# EAGLE design relay_box (EAGLE 9.6.2)
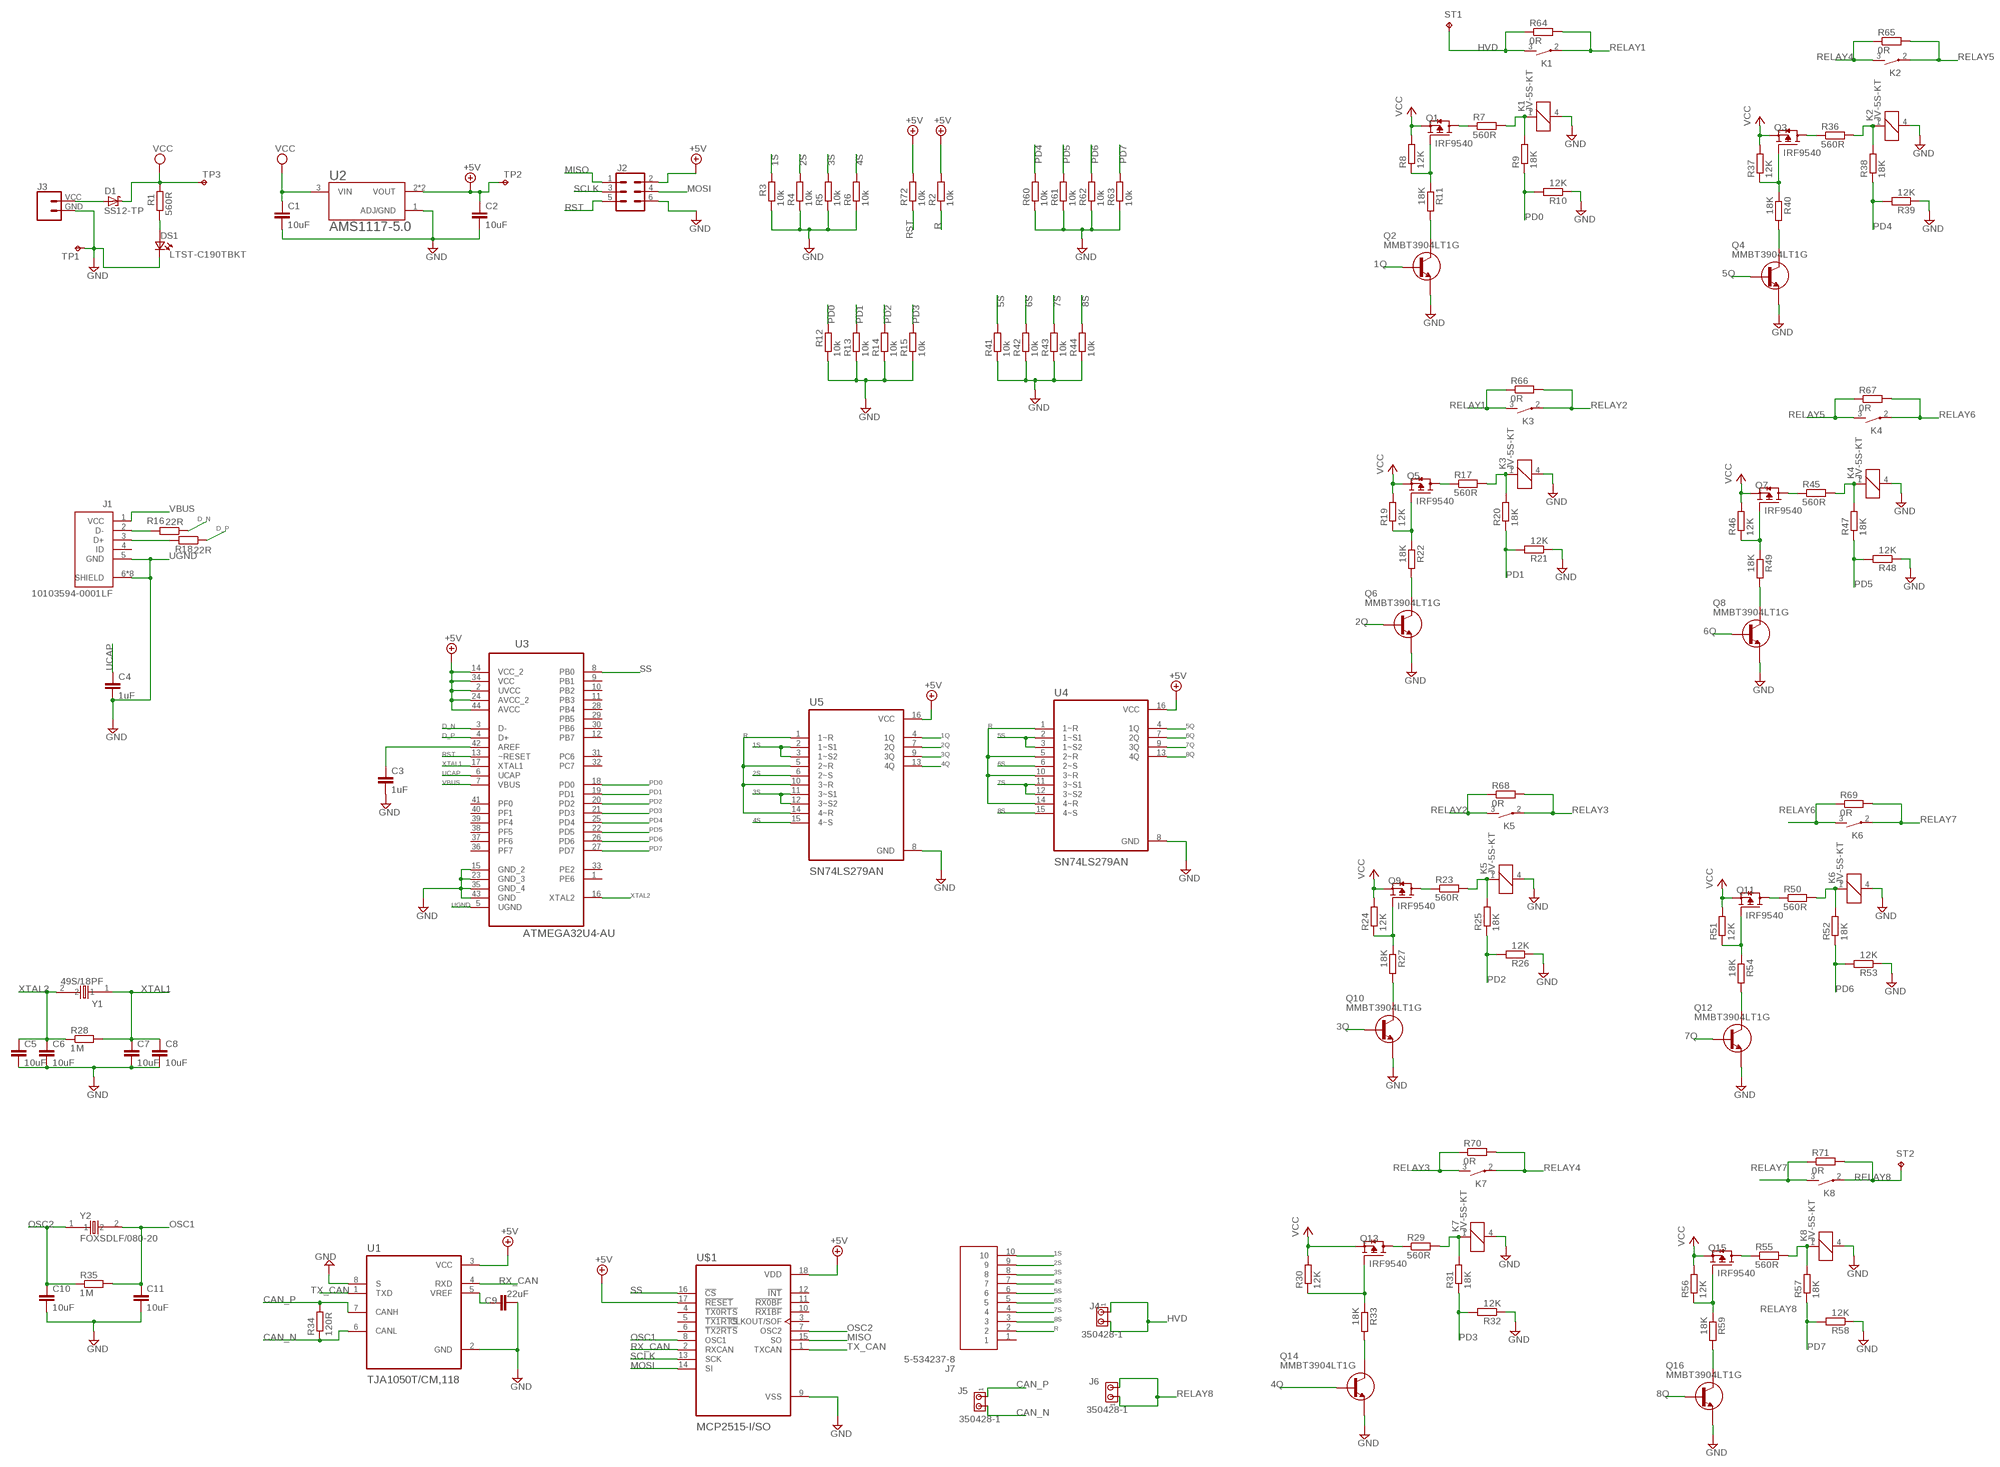
[diagram p0: schematic, sheet 1]

## Parts
C1  10uF  C-EUC0805  [C0805]
C2  10uF  C-EUC0805  [C0805]
C3  1uF  C-EUC0603  [C0603]
C4  1uF  C-EUC0603  [C0603]
C5  10uF  C-EUC0805  [C0805]
C6  10uF  C-EUC0805  [C0805]
C7  10uF  C-EUC0805  [C0805]
C8  10uF  C-EUC0805  [C0805]
C9  22uF  C-EUC0603  [C0603]
C10  10uF  C-EUC0805  [C0805]
C11  10uF  C-EUC0805  [C0805]
D1  SS12-TP  [DO214AC]
DS1  LTST-C190TBKT  [0603]
J1  10103594-0001LF  [AMPHENOL_10103594-0001LF]
J2  CONN_03X2FEMALE_SMD  [2X3_SMD]
J3  CONN_024UCON-15767  [JST-2-SMD-VERT]
J4  350428-1  [350428-1]
J5  350428-1  [350428-1]
J6  350428-1  [350428-1]
J7  5-534237-8  [RHDR10W76P0X254_1X10_2540X356X]
K1  JV-5S-KT  [JV-KT]
K2  JV-5S-KT  [JV-KT]
K3  JV-5S-KT  [JV-KT]
K4  JV-5S-KT  [JV-KT]
K5  JV-5S-KT  [JV-KT]
K6  JV-5S-KT  [JV-KT]
K7  JV-5S-KT  [JV-KT]
K8  JV-5S-KT  [JV-KT]
Q1  IRF9540  [TO254P1052X465X1989-3]
Q2  MMBT3904LT1G  [SOT23]
Q3  IRF9540  [TO254P1052X465X1989-3]
Q4  MMBT3904LT1G  [SOT23]
Q5  IRF9540  [TO254P1052X465X1989-3]
Q6  MMBT3904LT1G  [SOT23]
Q7  IRF9540  [TO254P1052X465X1989-3]
Q8  MMBT3904LT1G  [SOT23]
Q9  IRF9540  [TO254P1052X465X1989-3]
Q10  MMBT3904LT1G  [SOT23]
Q11  IRF9540  [TO254P1052X465X1989-3]
Q12  MMBT3904LT1G  [SOT23]
Q13  IRF9540  [TO254P1052X465X1989-3]
Q14  MMBT3904LT1G  [SOT23]
Q15  IRF9540  [TO254P1052X465X1989-3]
Q16  MMBT3904LT1G  [SOT23]
R1  560R  R-EU_R0805  [R0805]
R2  10k  R-EU_R0805  [R0805]
R3  10k  R-EU_R0805  [R0805]
R4  10k  R-EU_R0805  [R0805]
R5  10k  R-EU_R0805  [R0805]
R6  10k  R-EU_R0805  [R0805]
R7  560R  R-EU_0207/10  [0207/10]
R8  12K  R-EU_R0805  [R0805]
R9  18K  R-EU_R0805  [R0805]
R10  12K  R-EU_R0805  [R0805]
R11  18K  R-EU_R0805  [R0805]
R12  10k  R-EU_R0805  [R0805]
R13  10k  R-EU_R0805  [R0805]
R14  10k  R-EU_R0805  [R0805]
R15  10k  R-EU_R0805  [R0805]
R16  22R  R-EU_R0805  [R0805]
R17  560R  R-EU_0207/10  [0207/10]
R18  22R  R-EU_R0805  [R0805]
R19  12K  R-EU_R0805  [R0805]
R20  18K  R-EU_R0805  [R0805]
R21  12K  R-EU_R0805  [R0805]
R22  18K  R-EU_R0805  [R0805]
R23  560R  R-EU_0207/10  [0207/10]
R24  12K  R-EU_R0805  [R0805]
R25  18K  R-EU_R0805  [R0805]
R26  12K  R-EU_R0805  [R0805]
R27  18K  R-EU_R0805  [R0805]
R28  1M  R-EU_R0805  [R0805]
R29  560R  R-EU_0207/10  [0207/10]
R30  12K  R-EU_R0805  [R0805]
R31  18K  R-EU_R0805  [R0805]
R32  12K  R-EU_R0805  [R0805]
R33  18K  R-EU_R0805  [R0805]
R34  120R  R-EU_R0805  [R0805]
R35  1M  R-EU_R0805  [R0805]
R36  560R  R-EU_0207/10  [0207/10]
R37  12K  R-EU_R0805  [R0805]
R38  18K  R-EU_R0805  [R0805]
R39  12K  R-EU_R0805  [R0805]
R40  18K  R-EU_R0805  [R0805]
R41  10k  R-EU_R0805  [R0805]
R42  10k  R-EU_R0805  [R0805]
R43  10k  R-EU_R0805  [R0805]
R44  10k  R-EU_R0805  [R0805]
R45  560R  R-EU_0207/10  [0207/10]
R46  12K  R-EU_R0805  [R0805]
R47  18K  R-EU_R0805  [R0805]
R48  12K  R-EU_R0805  [R0805]
R49  18K  R-EU_R0805  [R0805]
R50  560R  R-EU_0207/10  [0207/10]
R51  12K  R-EU_R0805  [R0805]
R52  18K  R-EU_R0805  [R0805]
R53  12K  R-EU_R0805  [R0805]
R54  18K  R-EU_R0805  [R0805]
R55  560R  R-EU_0207/10  [0207/10]
R56  12K  R-EU_R0805  [R0805]
R57  18K  R-EU_R0805  [R0805]
R58  12K  R-EU_R0805  [R0805]
R59  18K  R-EU_R0805  [R0805]
R60  10k  R-EU_R0805  [R0805]
R61  10k  R-EU_R0805  [R0805]
R62  10k  R-EU_R0805  [R0805]
R63  10k  R-EU_R0805  [R0805]
R64  0R  R-EU_0207/10  [0207/10]
R65  0R  R-EU_0207/10  [0207/10]
R66  0R  R-EU_0207/10  [0207/10]
R67  0R  R-EU_0207/10  [0207/10]
R68  0R  R-EU_0207/10  [0207/10]
R69  0R  R-EU_0207/10  [0207/10]
R70  0R  R-EU_0207/10  [0207/10]
R71  0R  R-EU_0207/10  [0207/10]
R72  10k  R-EU_R0805  [R0805]
ST1  TPB1,27  [B1,27]
ST2  TPB1,27  [B1,27]
TP1  TPB1,27  [B1,27]
TP2  TPB1,27  [B1,27]
TP3  TPB1,27  [B1,27]
U1  TJA1050T/CM,118  [SOIC127P600X175-8N]
U2  AMS1117-5.0  [SOT229P700X180-4N]
U3  ATMEGA32U4-AU  [QFP80P1200X1200X120-44N]
U4  SN74LS279AN  [DIP794W45P254L1969H508Q16]
U5  SN74LS279AN  [DIP794W45P254L1969H508Q16]
U$1  MCP2515-I/SO  [SOIC127P1030X265-18N]
Y1  49S/18PF  [XTAL_49S/18PF]
Y2  FOXSDLF/080-20  [XTAL1170X500X450]

## Nets
1Q: Q2.1(B) U5.4(1Q)
1S: J7.10 R3.2 U5.2(1~S1) U5.3(1~S2)
2Q: Q6.1(B) U5.7(2Q)
2S: J7.9 R4.2 U5.6(2~S)
3Q: Q10.1(B) U5.9(3Q)
3S: J7.8 R5.2 U5.11(3~S1) U5.12(3~S2)
4Q: Q14.1(B) U5.13(4Q)
4S: J7.7 R6.2 U5.15(4~S)
5Q: Q4.1(B) U4.4(1Q)
5S: J7.6 R41.2 U4.2(1~S1) U4.3(1~S2)
6Q: Q8.1(B) U4.7(2Q)
6S: J7.5 R42.2 U4.6(2~S)
7Q: Q12.1(B) U4.9(3Q)
7S: J7.4 R43.2 U4.11(3~S1) U4.12(3~S2)
8Q: Q16.1(B) U4.13(4Q)
8S: J7.3 R44.2 U4.15(4~S)
+5V: C2.1 J2.2 R2.2 R72.2 TP2.TP U1.3(VCC) U2.2(VOUT) U2.4(VOUT) U3.2(UVCC) U3.14(VCC_2) U3.24(AVCC_2) U3.34(VCC) U3.44(AVCC) U4.16(VCC) U5.16(VCC) U$1.17(!RESET)
CAN_N: J5.2 R34.1 U1.6(CANL)
CAN_P: J5.1 R34.2 U1.7(CANH)
D_N: R16.1 U3.3(D-)
D_P: R18.1 U3.4(D+)
GND: C1.2 C2.2 C3.2 C5.2 C6.2 C7.2 C8.2 C9.2 C10.2 C11.2 DS1.1(K2) J2.6 J3.GND K1.4 K2.4 K3.4 K4.4 K5.4 K6.4 K7.4 K8.4 Q2.2(E) Q4.2(E) Q6.2(E) Q8.2(E) Q10.2(E) Q12.2(E) Q14.2(E) Q16.2(E) R3.1 R4.1 R5.1 R6.1 R10.1 R12.1 R13.1 R14.1 R15.1 R21.1 R26.1 R32.1 R39.1 R41.1 R42.1 R43.1 R44.1 R48.1 R53.1 R58.1 R60.1 R61.1 R62.1 R63.1 TP1.TP U1.2(GND) U1.8(S) U2.1(ADJ/GND) U3.15(GND_2) U3.23(GND_3) U3.35(GND_4) U3.43(GND) U4.8(GND) U5.8(GND) U$1.9(VSS)
HVD: J4.1 J4.2 K1.3(S) R64.1 ST1.TP
MISO: J2.1 U$1.15(SO)
MOSI: J2.4 U$1.14(SI)
N$1: Q1.1(G) R8.1 R11.1
N$2: Q1.2(D) R7.1
N$3: Q2.3(C) R11.2
N$4: K1.1 R7.2 R9.2
N$5: Q3.1(G) R37.1 R40.1
N$6: Q4.3(C) R40.2
N$7: K2.1 R36.2 R38.2
N$8: Q3.2(D) R36.1
N$9: Q5.1(G) R19.1 R22.1
N$10: Q6.3(C) R22.2
N$11: K3.1 R17.2 R20.2
N$12: Q5.2(D) R17.1
N$13: Q7.1(G) R46.1 R49.1
N$14: Q8.3(C) R49.2
N$15: K4.1 R45.2 R47.2
N$16: Q7.2(D) R45.1
N$17: Q9.1(G) R24.1 R27.1
N$18: Q10.3(C) R27.2
N$19: K5.1 R23.2 R25.2
N$20: Q9.2(D) R23.1
N$21: Q11.1(G) R51.1 R54.1
N$22: Q12.3(C) R54.2
N$23: K6.1 R50.2 R52.2
N$24: Q11.2(D) R50.1
N$25: Q13.1(G) R30.1 R33.1
N$26: Q14.3(C) R33.2
N$27: K7.1 R29.2 R31.2
N$28: Q13.2(D) R29.1
N$29: Q15.1(G) R56.1 R59.1
N$30: Q16.3(C) R59.2
N$31: K8.1 R55.2 R57.2
N$32: Q15.2(D) R55.1
N$33: DS1.2(A2) R1.1
N$34: D1.A J3.VCC
N$36: J1.2(D-) R16.2
N$37: J1.3(D+) R18.2
N$38: C9.1 U1.5(VREF)
N$51: C3.1 U3.42(AREF)
N$54: U$1.18(VDD) ; supply symbol labelled +5V
OSC1: C11.1 R35.2 U$1.8(OSC1) Y2.2
OSC2: C10.1 R35.1 U$1.7(OSC2) Y2.1
PD0: R9.1 R10.2 R12.2 U3.18(PD0)
PD1: R13.2 R20.1 R21.2 U3.19(PD1)
PD2: R14.2 R25.1 R26.2 U3.20(PD2)
PD3: R15.2 R31.1 R32.2 U3.21(PD3)
PD4: R38.1 R39.2 R60.2 U3.25(PD4)
PD5: R47.1 R48.2 R61.2 U3.22(PD5)
PD6: R52.1 R53.2 R62.2 U3.26(PD6)
PD7: R57.1 R58.2 R63.2 U3.27(PD7)
R: J7.2 R2.1 U4.1(1~R) U4.5(2~R) U4.10(3~R) U4.14(4~R) U5.1(1~R) U5.5(2~R) U5.10(3~R) U5.14(4~R)
RELAY1: K1.2(P) K3.3(S) R64.2 R66.1
RELAY2: K3.2(P) K5.3(S) R66.2 R68.1
RELAY3: K5.2(P) K7.3(S) R68.2 R70.1
RELAY4: K2.3(S) K7.2(P) R65.1 R70.2
RELAY5: K2.2(P) K4.3(S) R65.2 R67.1
RELAY6: K4.2(P) K6.3(S) R67.2 R69.1
RELAY7: K6.2(P) K8.3(S) R69.2 R71.1
RELAY8: J6.1 J6.2 K8.2(P) R71.2 ST2.TP
RST: J2.5 R72.1 U3.13(~RESET)
RX_CAN: U1.4(RXD) U$1.2(RXCAN)
SCLK: J2.3 U$1.13(SCK)
SS: U3.8(PB0) U$1.16(!CS)
TX_CAN: U1.1(TXD) U$1.1(TXCAN)
UCAP: C4.1 U3.6(UCAP)
UGND: C4.2 J1.5(GND) J1.6(SHIELD) J1.7(SHIELD) J1.8(SHIELD) J1.9(SHIELD) J1.10(SHIELD) J1.11(SHIELD) J1.S1(SHIELD) J1.S2(SHIELD) U3.5(UGND) ; supply symbol labelled GND
VBUS: J1.1(VCC) U3.7(VBUS)
VCC: C1.1 D1.C Q1.3(S) Q3.3(S) Q5.3(S) Q7.3(S) Q9.3(S) Q11.3(S) Q13.3(S) Q15.3(S) R1.2 R8.2 R19.2 R24.2 R30.2 R37.2 R46.2 R51.2 R56.2 TP3.TP U2.3(VIN)
XTAL1: C7.1 C8.1 R28.2 U3.17(XTAL1) Y1.1
XTAL2: C5.1 C6.1 R28.1 U3.16(XTAL2) Y1.2
Unconnected: J1.4(ID) J7.1 U3.1(PE6) U3.9(PB1) U3.10(PB2) U3.11(PB3) U3.12(PB7) U3.28(PB4) U3.29(PB5) U3.30(PB6) U3.31(PC6) U3.32(PC7) U3.33(PE2) U3.36(PF7) U3.37(PF6) U3.38(PF5) U3.39(PF4) U3.40(PF1) U3.41(PF0) U$1.3(CLKOUT/SOF) U$1.4(!TX0RTS) U$1.5(!TX1RTS) U$1.6(!TX2RTS) U$1.10(!RX1BF) U$1.11(!RX0BF) U$1.12(!INT)

## Library data of the parts
C1-C11 = rcl:C-EU: CAPACITOR, European symbol; SPICEPREFIX: C
D1 = SS12-TP:SS12-TP: http://octopart.com/ss12-fairchild+semiconductor-13414068 Check prices <https://pricing.snapeda.com/parts/SS12-TP/Micro%20Commercial/view-part?ref=eda>; AVAILABILITY: Warning; DESCRIPTION: Diode Schottky 20V 1A Surface Mount DO-214AC (SMA); MF: Micro Commercial; MP: SS12-TP; PACKAGE: DO-214 MCC; PRICE: None
DS1 = LTST-C190TBKT:LTST-C190TBKT: http://octopart.com/ltst-c190tbkt-lite-on-550003 Check prices <https://pricing.snapeda.com/parts/LTST-C190TBKT/Lite-On%20Inc./view-part?ref=eda>; AVAILABILITY: Warning; DESCRIPTION: Blue 470nm LED Indication - Discrete 3.3V 0603 (1608 Metric); MF: Lite-On Inc.; MP: LTST-C190TBKT; PACKAGE: 0603 Lite-On; PRICE: None; PURCHASE-URL: https://pricing.snapeda.com/search/part/LTST-C190TBKT/?ref=eda
J1 = 10103594-0001LF:10103594-0001LF: USB - micro B USB 2.0 Receptacle Connector 5 Position Surface Mount, Right Angle; Through Hole Check prices <https://pricing.snapeda.com/parts/10103594-0001LF/Amphenol%20ICC%20%28FCI%29/view-part?ref=eda>; AVAILABILITY: Good; DESCRIPTION: USB - micro B USB 2.0 Receptacle Connector 5 Position Surface Mount, Right Angle; Through Hole; MF: Amphenol ICC (FCI); MP: 10103594-0001LF; PACKAGE: None; PRICE: None; PURCHASE-URL: https://pricing.snapeda.com/search/part/10103594-0001LF/?ref=eda
J2 = SparkFun-Connectors:CONN_03X2: Multi connection point. Often used as Generic Header-pin footprint for 0.1 inch spaced/style header connections You can populate with any combo of single row headers, but if you'd like an exact match, check these: Header - 2x3 (Male, 0.1") <https://www.sparkfun.com/products/12807> (PRT-12807) Header - 2x3 (Female, 0.1") <https://www.sparkfun.com/products/13010> (PRT-13010) 2x3 Pin Shrouded Header <https://www.sparkfun.com/products/10877> (PRT-10877) On any of the 0.1 inch spaced packages, you can populate with these: Break Away Headers - Straight <https://www.sparkfun.com/products/116> (PRT-00116) Break Away Male Headers - Right Angle <https://www.sparkfun.com/products/553> (PRT-00553) Female Headers <https://www.sparkfun.com/products/115> (PRT-00115) Break Away Headers - Machine Pin <https://www.sparkfun.com/products/117> (PRT-00117) Break Away Female Headers - Swiss Machine Pin <https://www.sparkfun.com/products/743> (PRT-00743) Special note: the shrouded connector mates well with our 3x2 ribbon cables: Ribbon Crimp Connector - 6-pin (2x3, Female) <https://www.sparkfun.com/products/10651> (PRT-10651) Ribbon Cable - 6 wire (15ft) <https://www.sparkfun.com/products/10646> (PRT-10646); PROD_ID: CONN-11290
J3 = SparkFun-Connectors:CONN_02: Multi connection point. Often used as Generic Header-pin footprint for 0.1 inch spaced/style header connections On any of the 0.1 inch spaced packages, you can populate with these: Break Away Headers - Straight <https://www.sparkfun.com/products/116> (PRT-00116) Break Away Male Headers - Right Angle <https://www.sparkfun.com/products/553> (PRT-00553) Female Headers <https://www.sparkfun.com/products/115> (PRT-00115) Break Away Headers - Machine Pin <https://www.sparkfun.com/products/117> (PRT-00117) Break Away Female Headers - Swiss Machine Pin <https://www.sparkfun.com/products/743> (PRT-00743) For SCREWTERMINALS and SPRING TERMINALS visit here: Screw Terimnals on SparkFun.com <https://www.sparkfun.com/search/results?term=Screw+Terminals> (5mm/3.5mm/2.54mm spacing) This device is also useful as a general connection point to wire up your design to another part of your project. Our various solder wires solder well into these plated through hole pads. Hook-Up Wire - Assortment (Stranded, 22 AWG) <https://www.sparkfun.com/products/11375> (PRT-11375) Hook-Up Wire - Assortment (Solid Core, 22 AWG) <https://www.sparkfun.com/products/11367> (PRT-11367) View the entire wire category on our website here <https://www.sparkfun.com/categories/141> Special notes: Molex polarized connector foot print use with: PRT-08233 with associated crimp pins and housings. 2.54_SCREWTERM for use with PRT-10571. 3.5mm Screw Terminal footprints for PRT-08084 5mm Screw Terminal footprints for use with PRT-08432
J4-J6 = 350428-1:350428-1: Universal MATE-N-LOK .250" Centerline, 600 V, 19 - 36 A max Source: http://catalog.tycoelectronics.com/ .. ENG_CD_350428_Y.pdf Check prices <https://pricing.snapeda.com/parts/350428-1/TE%20Connectivity/view-part?ref=eda>; AVAILABILITY: Good; COMMENT: 350428-1; DESCRIPTION: Connector Power Header 2 Position 6.35mm Solder Straight Through Hole 2 Terminal 1 Port; EU_ROHS_COMPLIANCE: Compliant; MF: TE Connectivity; MP: 350428-1; PACKAGE: None; PRICE: None; PURCHASE-URL: https://pricing.snapeda.com/search/part/350428-1/?ref=eda
J7 = 5-534237-8:5-534237-8: 10 MODII VRT SR CE 100/115 Source: Datasheet <https://datasheet.datasheetarchive.com/originals/dk/DKDS-21/419128.pdf>; ARROW_PART_NUMBER: 5-534237-8; ARROW_PRICE-STOCK: https://www.arrow.com/en/products/5-534237-8/te-connectivity; DESCRIPTION: 10 MODII VRT SR CE 100/115; HEIGHT: 8.89mm; MANUFACTURER_NAME: TE Connectivity; MANUFACTURER_PART_NUMBER: 5-534237-8; MOUSER_PART_NUMBER: 571-5-534237-8; MOUSER_PRICE-STOCK: https://www.mouser.co.uk/ProductDetail/TE-Connectivity/5-534237-8?qs=GYgf5PdsjzlQgV8qvw0nOw%3D%3D
K1-K8 = relay:JV*-KT: POWER RELAY JV SERIES 1 POLE—5 A (MEDIUM LOAD CONTROL) Source: Data sheet <http://www.produktinfo.conrad.com/datenblaetter/500000-524999/502946-da-01-en-RELAIS_JV_12S_KT.pdf>
Q1 Q3 Q5 Q7 Q9 Q11 Q13 Q15 = IRF9540:IRF9540: Trans MOSFET P-CH 100V 6.8A 3-Pin(3+Tab) TO-220AB Check prices <https://pricing.snapeda.com/parts/IRF9540/Vishay%20Siliconix/view-part?ref=eda>; AVAILABILITY: Bad; DESCRIPTION: P-Channel 100V 19A (Tc) 150W (Tc) Through Hole TO-220AB; MF: Vishay Siliconix; MP: IRF9540; PACKAGE: TO-220 International Rectifier; PRICE: None
Q2 Q4 Q6 Q8 Q10 Q12 Q14 Q16 = MMBT3904LT1G:MMBT3904LT1G: http://octopart.com/mmbt3904lt1g-on+semiconductor-3280 Check prices <https://pricing.snapeda.com/parts/MMBT3904LT1G/ON%20Semiconductor/view-part?ref=eda>; AVAILABILITY: Good; DESCRIPTION: Bipolar (BJT) Transistor NPN 40V 200mA 300MHz 300mW Surface Mount SOT-23-3 (TO-236); MF: ON Semiconductor; MP: MMBT3904LT1G; PACKAGE: SOT-23-3 ON Semiconductor; PRICE: None; PURCHASE-URL: https://pricing.snapeda.com/search/part/MMBT3904LT1G/?ref=eda
R1-R72 = rcl:R-EU_: RESISTOR, European symbol; SPICEPREFIX: R
ST1 ST2 TP1-TP3 = testpad:TP: Test pad
U1 = TJA1050T_CM_118:TJA1050T/CM,118: None Check prices <https://pricing.snapeda.com/parts/TJA1050T/CM%2C118/NXP%20USA/view-part?ref=eda>; AVAILABILITY: Good; DESCRIPTION: 1/1 Transceiver Half CANbus 8-SO; MF: NXP USA; MP: TJA1050T/CM,118; PACKAGE: SO-8 NXP Semiconductors; PRICE: None; PURCHASE-URL: https://pricing.snapeda.com/search/part/TJA1050T/CM,118/?ref=eda
U2 = AMS1117-5.0:AMS1117-5.0: Sot223/Pkg 1-Amp 5-Volt Low Drop Out Voltage Regulatator; AVAILABILITY: Unavailable; DESCRIPTION: Sot223/Pkg 1-Amp 5-Volt Low Drop Out Voltage Regulatator; MF: Advanced Monolithic Systems; MP: AMS1117-5.0; PACKAGE: None; PRICE: None
U3 = ATMEGA32U4-AU:ATMEGA32U4-AU: 8-bit Microcontroller with ISP Flash and USB Controller Check prices <https://pricing.snapeda.com/parts/ATMEGA32U4-AU/Microchip%20Technology%20/%20Atmel/view-part?ref=eda>; AVAILABILITY: Good; DESCRIPTION: 8-bit Microcontrollers - MCU AVR USB 32K FLASH INDUSTRIAL; MF: Microchip Technology / Atmel; MP: ATMEGA32U4-AU; PACKAGE: None; PRICE: None; PURCHASE-URL: https://pricing.snapeda.com/search/part/ATMEGA32U4-AU/?ref=eda
U4 U5 = SN74LS279AN:SN74LS279AN: Check prices <https://pricing.snapeda.com/parts/SN74LS279AN/Texas%20Instruments/view-part?ref=eda>; AVAILABILITY: Good; DESCRIPTION: Quad /S-/R latches 16-PDIP 0 to 70; MF: Texas Instruments; MP: SN74LS279AN; PACKAGE: PDIP-16 Texas Instruments; PRICE: None; PURCHASE-URL: https://pricing.snapeda.com/search/part/SN74LS279AN/?ref=eda
U$1 = MCP2515-I_SO:MCP2515-I/SO: Check prices <https://pricing.snapeda.com/parts/MCP2515-I/SO/Microchip/view-part?ref=eda>; AVAILABILITY: Good; DESCRIPTION: CANbus Controller CAN 2.0 SPI Interface 18-SOIC; MF: Microchip; MP: MCP2515-I/SO; PACKAGE: SOIC-18 Microchip; PRICE: None; PURCHASE-URL: https://pricing.snapeda.com/search/part/MCP2515-I/SO/?ref=eda
Y1 = 49S_18PF:49S/18PF: DIP Crystal 16MHz-18pF-30ppm-50R; AVAILABILITY: Unavailable; DESCRIPTION: DIP Crystal 16MHz-18pF-30ppm-50R;; MF: Xinhunjing; MP: 49S/18PF; PACKAGE: None; PRICE: None
Y2 = FOXSDLF_080-20:FOXSDLF/080-20: Crystal 8MHz 30ppm (Tol) 50ppm (Stability) 20pF FUND 80Ohm 2-Pin HC-49/SDLF SMD T/R Check prices <https://pricing.snapeda.com/parts/FOXSDLF/080-20/Fox%20Electronics/view-part?ref=eda>; AVAILABILITY: Warning; DESCRIPTION: 8MHz ±30ppm Crystal 20pF 80 Ohms HC-49/US; MF: Fox Electronics; MP: FOXSDLF/080-20; PACKAGE: HC-49/US Fox Electronics; PRICE: None; PURCHASE-URL: https://pricing.snapeda.com/search/part/FOXSDLF/080-20/?ref=eda

## Board
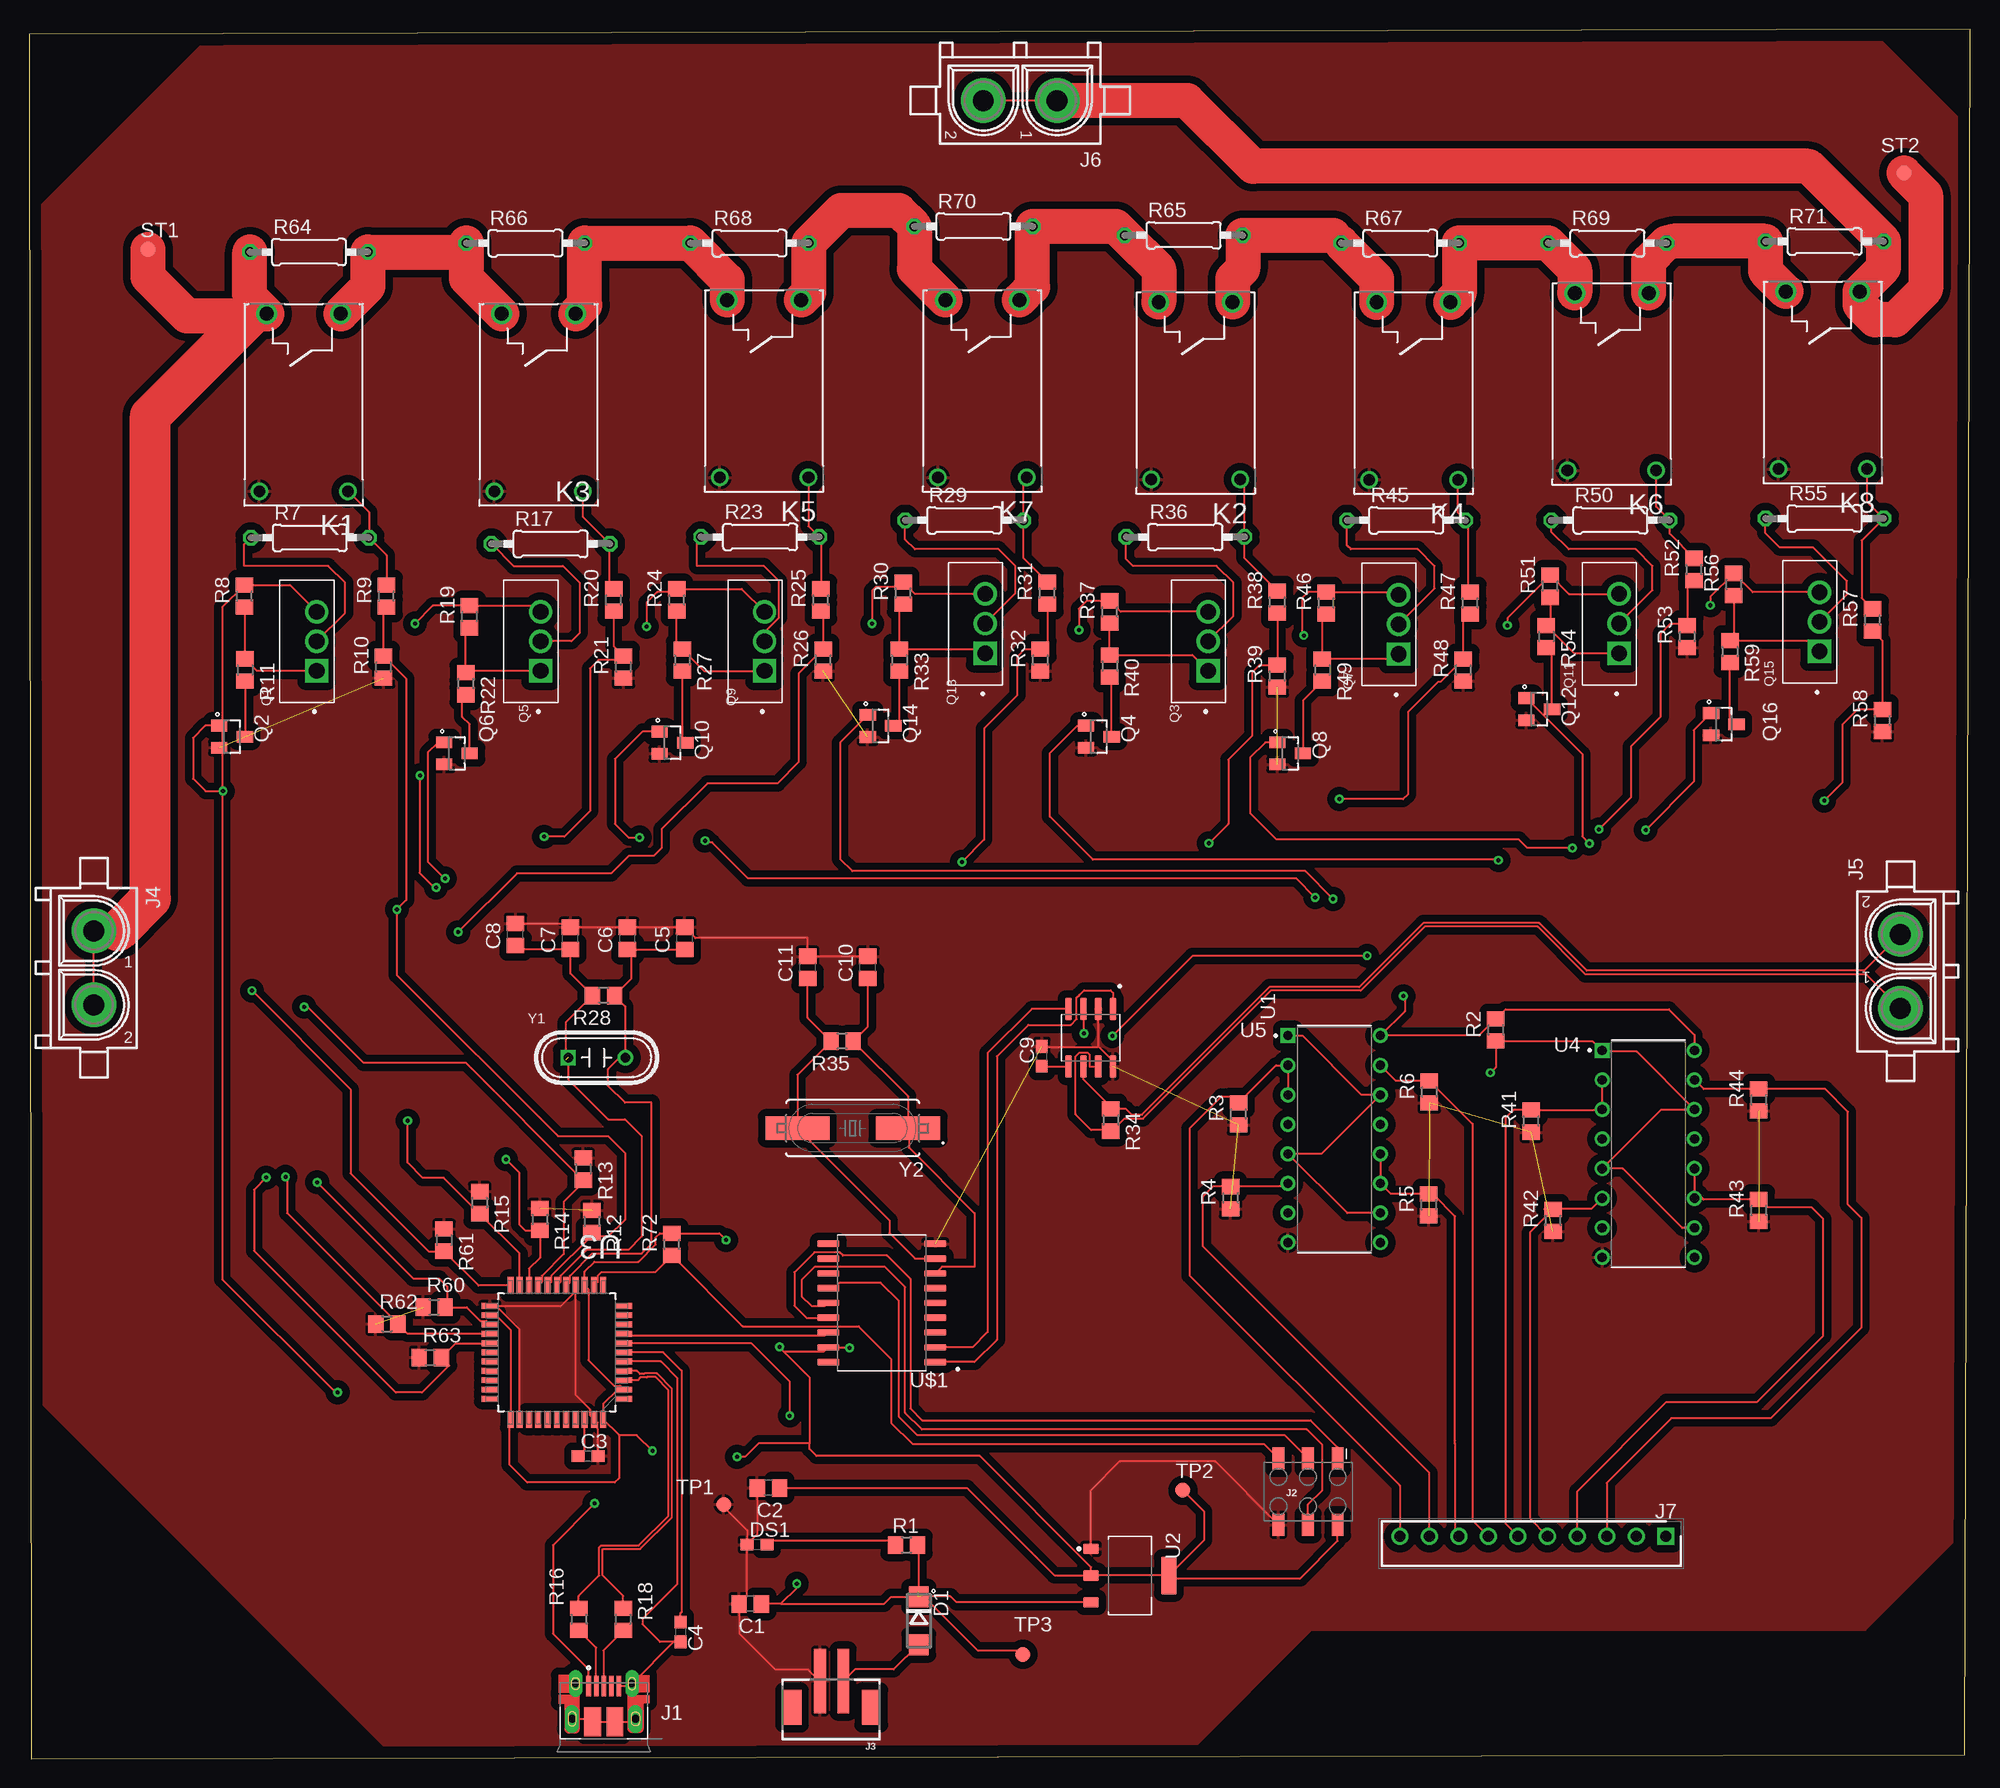
[diagram p1: board, top side]
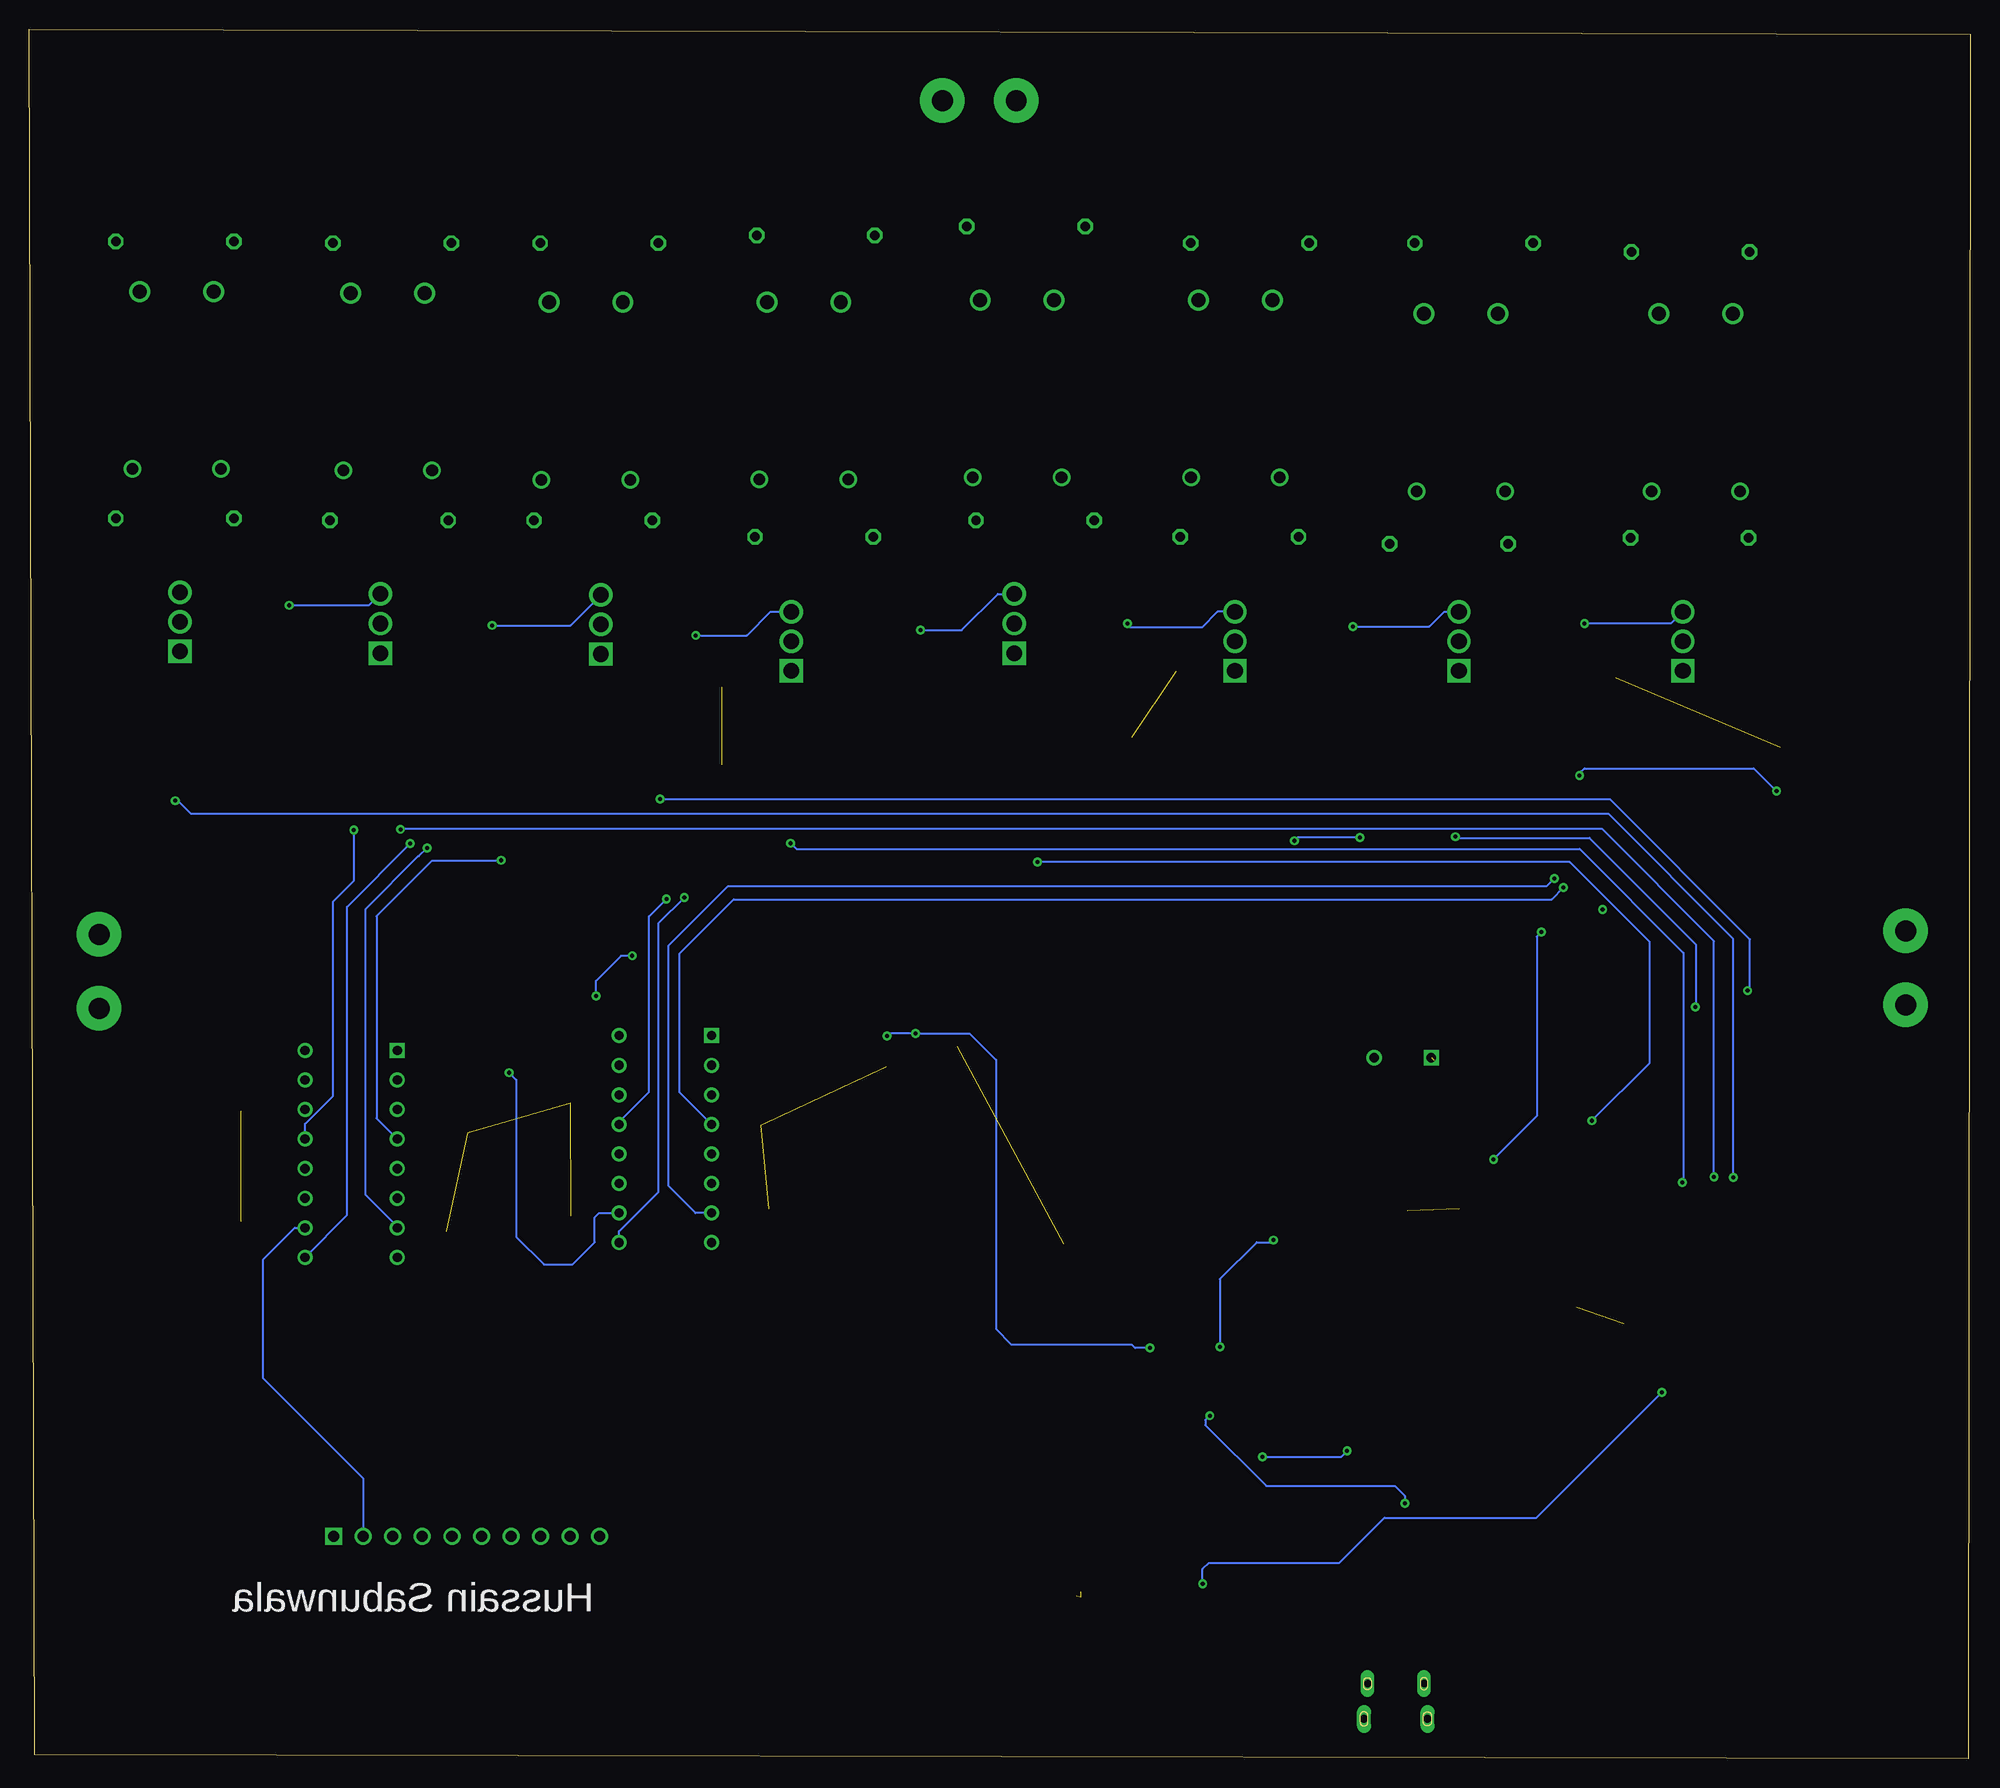
[diagram p2: board, bottom side, seen from below]

Size 166.76 x 148.59 mm. Coordinates in mm from the lower left corner, seen from the top.
Outline: 166.26,0.35 166.76,148.59 0,148.16 0.18,0 166.26,0.35
Copper layers (1*16): Top 0.035mm / dielectric 1.5mm / Bottom 0.035mm
Design rules "default": minimum track width 6mil, minimum drill 0.35mm, track to track 6mil, track to pad 6mil, pad to pad 6mil, via to via 6mil, smd to smd 6mil, copper to edge 40mil, drill to drill 6mil, minimum pad ring 10mil, minimum via ring 8mil, stop-mask expansion 4mil, vias tented up to drill 0mil, thermal gap 10mil

### Footprints (pad centres in the part's own frame; a part is rotated, then mirrored left to right if it is on the bottom)
C0805 = smd 1.3 x 1.5: 1 -0.95,0; 2 0.95,0
C0603 = smd 1.1 x 1: 1 -0.85,0; 2 0.85,0
DO214AC = smd 1.8 x 1.7: A 2.05,0; C -2.05,0
0603 = smd 1.1 x 1: 1 -0.85,0; 2 0.85,0
AMPHENOL_10103594-0001LF = smd 0.4 x 1.75: 1 -1.3,2.825; 2 -0.65,2.825; 3 0,2.825; 4 0.65,2.825; 5 1.3,2.825 | drill 0.65 pad 0.73 long: 6 -2.425,3.03; 7 2.425,3.03 | drill 0.7 pad 1.2 long: 8 -2.725,0; 9 2.725,0 | smd 1.05 x 2.1 bottom: 10 -2.425,3.03; 11 2.425,3.03 | smd 1.425 x 2.5: S1 -0.963,-0.25; S2 0.963,-0.25
2X3_SMD = smd 1.02 x 1.9: 1 -2.54,-2.85; 2 -2.54,2.85; 3 0,-2.85; 4 0,2.85; 5 2.54,-2.85; 6 2.54,2.85
JST-2-SMD-VERT = smd 1 x 5.5: GND 1,-2; VCC -1,-2 | smd 1.6 x 3: P$1 -3.4,0.27; P$2 3.4,0.27
350428-1 = drill 1.8 pad 3.81: 1 -3.175,0; 2 3.175,0
RHDR10W76P0X254_1X10_2540X356X = drill 0.95 pad 1.425 square: 1 0,0 | drill 0.95 pad 1.425: 2 2.54,0; 3 5.08,0; 4 7.62,0; 5 10.16,0; 6 12.7,0; 7 15.24,0; 8 17.78,0; 9 20.32,0; 10 22.86,0
JV-KT = drill 1: 1 -7.62,-3.81; 4 -7.62,3.81 | drill 1.2: 2 7.62,-3.175; 3 7.62,3.175
TO254P1052X465X1989-3 = drill 1.34 pad 2.01 square: 1 0,0 | drill 1.34 pad 2.01: 2 2.54,0; 3 5.08,0
SOT23 = smd 1.4 x 1: 1 -1.1,0.95; 2 -1.1,-0.95; 3 1.1,0
R0805 = smd 1.3 x 1.5: 1 -0.95,0; 2 0.95,0
0207/10 = drill 0.813 octagon: 1 -5.08,0; 2 5.08,0
B1,27 = smd 1.27 x 1.27: TP 0,0
SOIC127P600X175-8N = smd 1.95 x 0.59: 1 -2.48,1.905; 2 -2.48,0.635; 3 -2.48,-0.635; 4 -2.48,-1.905; 5 2.48,-1.905; 6 2.48,-0.635; 7 2.48,0.635; 8 2.48,1.905
SOT229P700X180-4N = smd 0.93 x 1.31: 1 -2.29,-3.345; 2 0,-3.345; 3 2.29,-3.345 | smd 3.24 x 1.31: 4 0,3.345
QFP80P1200X1200X120-44N = smd 1.473 x 0.508: 1 -5.74,3.988; 2 -5.74,3.2; 3 -5.74,2.388; 4 -5.74,1.6; 5 -5.74,0.787; 6 -5.74,0; 7 -5.74,-0.787; 8 -5.74,-1.6; 9 -5.74,-2.388; 10 -5.74,-3.2; 11 -5.74,-3.988; 23 5.74,-3.988; 24 5.74,-3.2; 25 5.74,-2.388; 26 5.74,-1.6; 27 5.74,-0.787; 28 5.74,0; 29 5.74,0.787; 30 5.74,1.6; 31 5.74,2.388; 32 5.74,3.2; 33 5.74,3.988 | smd 0.508 x 1.473: 12 -3.988,-5.74; 13 -3.2,-5.74; 14 -2.388,-5.74; 15 -1.6,-5.74; 16 -0.787,-5.74; 17 0,-5.74; 18 0.787,-5.74; 19 1.6,-5.74; 20 2.388,-5.74; 21 3.2,-5.74; 22 3.988,-5.74; 34 3.988,5.74; 35 3.2,5.74; 36 2.388,5.74; 37 1.6,5.74; 38 0.787,5.74; 39 0,5.74; 40 -0.787,5.74; 41 -1.6,5.74; 42 -2.388,5.74; 43 -3.2,5.74; 44 -3.988,5.74
DIP794W45P254L1969H508Q16 = drill 0.78 pad 1.13 square: 1 -3.97,8.89 | drill 0.78 pad 1.13: 2 -3.97,6.35; 3 -3.97,3.81; 4 -3.97,1.27; 5 -3.97,-1.27; 6 -3.97,-3.81; 7 -3.97,-6.35; 8 -3.97,-8.89; 9 3.97,-8.89; 10 3.97,-6.35; 11 3.97,-3.81; 12 3.97,-1.27; 13 3.97,1.27; 14 3.97,3.81; 15 3.97,6.35; 16 3.97,8.89
SOIC127P1030X265-18N = smd 1.91 x 0.6: 1 -4.61,5.08; 2 -4.61,3.81; 3 -4.61,2.54; 4 -4.61,1.27; 5 -4.61,0; 6 -4.61,-1.27; 7 -4.61,-2.54; 8 -4.61,-3.81; 9 -4.61,-5.08; 10 4.61,-5.08; 11 4.61,-3.81; 12 4.61,-2.54; 13 4.61,-1.27; 14 4.61,0; 15 4.61,1.27; 16 4.61,2.54; 17 4.61,3.81; 18 4.61,5.08
XTAL_49S/18PF = drill 0.813 square: 1 -2.45,0 | drill 0.813: 2 2.45,0
XTAL1170X500X450 = smd 5.5 x 2: 1 -4.75,0; 2 4.75,0

### Placement (x,y rotation side)
C1  61.95,13.31 180 top
C2  63.5,23.27 180 top
C3  48.02,26.01 0 top
C4  55.97,10.9 270 top
C5  56.32,70.49 90 top
C6  51.41,70.49 90 top
C7  46.5,70.49 90 top
C8  41.78,70.82 90 top
C9  87,60.35 90 top
C10  72.06,67.99 90 top
C11  66.89,67.99 90 top
D1  76.42,11.86 270 top
DS1  62.53,18.4 0 top
J1  49.37,3.43 0 top
J2  109.86,22.96 180 top
J3  68.94,4.68 180 top
J4  5.56,67.95 270 top
J5  160.75,67.65 90 top
J6  85.14,142.45 180 top
J7  140.6,19.13 180 top
K1  23.59,116.51 90 top
K2  100.21,117.52 90 top
K3  43.77,116.51 90 top
K4  118.93,117.5 90 top
K5  63.14,117.69 90 top
K6  135.95,118.29 90 top
K7  81.88,117.69 90 top
K8  154.08,118.42 90 top
Q1  24.7,93.46 90 top
Q2  17.43,87.81 0 top
Q3  101.28,93.46 90 top
Q4  91.89,87.81 0 top
Q5  43.94,93.46 90 top
Q6  36.75,86.37 0 top
Q7  117.64,94.9 90 top
Q8  108.33,86.37 0 top
Q9  63.18,93.46 90 top
Q10  55.26,87.29 0 top
Q11  136.58,94.98 90 top
Q12  129.72,90.17 0 top
Q13  82.12,94.98 90 top
Q14  73.14,88.73 0 top
Q15  153.79,95.13 90 top
Q16  145.57,88.88 0 top
R1  75.37,18.37 0 top
R2  125.99,62.61 90 top
R3  103.89,55.4 90 top
R4  103.21,48.2 90 top
R5  120.24,47.58 90 top
R6  120.28,57.29 90 top
R7  24.12,104.89 0 top
R8  18.5,99.88 90 top
R9  30.7,99.88 90 top
R10  30.45,93.79 90 top
R11  18.56,93.54 270 top
R12  48.35,46.15 270 top
R13  47.61,50.66 270 top
R14  43.88,46.34 270 top
R15  38.71,47.78 270 top
R16  47.22,11.99 270 top
R17  44.8,104.37 0 top
R18  51.03,11.99 270 top
R19  37.84,98.11 90 top
R20  50.21,99.55 90 top
R21  51.06,93.79 90 top
R22  37.51,92.35 270 top
R23  62.8,104.96 0 top
R24  55.64,99.55 90 top
R25  68.01,99.55 90 top
R26  68.22,94.38 90 top
R27  56.11,94.38 270 top
R28  49.34,65.57 180 top
R29  80.34,106.4 0 top
R30  75.09,100.14 90 top
R31  87.46,100.14 90 top
R32  86.87,94.38 90 top
R33  74.76,94.38 270 top
R34  92.92,54.87 270 top
R35  69.84,61.64 180 top
R36  99.32,104.96 0 top
R37  92.82,98.52 90 top
R38  107.22,99.37 90 top
R39  107.22,93.02 90 top
R40  92.82,93.87 270 top
R41  129.03,54.78 90 top
R42  130.91,46.26 90 top
R43  148.58,47.1 90 top
R44  148.58,56.59 90 top
R45  118.3,106.4 0 top
R46  111.42,99.29 90 top
R47  123.79,99.29 90 top
R48  123.2,93.53 90 top
R49  111.09,93.53 270 top
R50  135.84,106.4 0 top
R51  130.66,100.73 90 top
R52  143.03,102.17 90 top
R53  142.44,96.41 90 top
R54  130.33,96.41 270 top
R55  154.23,106.55 0 top
R56  146.43,100.88 90 top
R57  158.36,97.84 90 top
R58  159.21,89.2 90 top
R59  146.1,95.12 270 top
R60  34.8,38.8 0 top
R61  35.65,44.56 270 top
R62  30.74,37.36 0 top
R63  34.47,34.48 0 top
R64  24.04,129.44 0 top
R65  99.18,130.88 0 top
R66  42.64,130.2 0 top
R67  117.78,130.2 0 top
R68  61.88,130.2 0 top
R69  135.58,130.2 0 top
R70  81.12,131.64 0 top
R71  154.23,130.35 0 top
R72  55.22,44.19 90 top
ST1  10.2,129.67 0 top
ST2  161.04,136.22 0 top
TP1  59.66,21.85 0 top
TP2  99.1,23.08 0 top
TP3  85.36,8.97 0 top
U1  91.2,61.94 270 top
U2  94.56,15.75 270 top
U3  45.34,34.92 180 top
U4  139.09,51.97 0 top
U5  112.12,53.23 0 top
U$1  73.24,39.16 180 top
Y1  48.76,60.24 0 top
Y2  70.75,54.17 180 top

### Tracks (layer width: path | path; a pad name or v marks a point on that pad's centre or on a via)
1Q  (via drill 0.35)
  Top 0.152: v33.57,84.47 33.54,84.44 33.54,76.11 34.81,74.84 v34.95,74.84 | Q2.1 15.14,88.76 14.09,87.71 14.09,84.2 15.16,83.13 v16.65,83.13
  Bottom 0.152: U5.4 110.91,57.27 110.91,69.15 106.23,73.83 35.96,73.83 v34.95,74.84 | v33.57,84.47 33.57,84.67 33.16,85.08 18.61,85.08 v16.65,83.13
1S
  Top 0.152: R3.2 103.9,56.36 | R3.2 107.12,59.58 U5.2 U5.3 | R3.2 103.34,56.9 102.43,56.9 99.69,54.16 99.69,41.53 117.74,23.47 J7.10
2Q  (via drill 0.35)
  Top 0.152: v35.73,75.63 35.7,75.63 34.25,77.08 34.25,86.45 35.12,87.32 Q6.1
  Bottom 0.152: U5.7 109.51,46.88 111.85,49.22 111.85,69.86 106.73,74.97 36.39,74.97 v35.73,75.63
2S
  Top 0.152: U5.6 107.87,49.15 R4.2 101.69,49.15 100.85,48.31 100.85,44.01 120.28,24.58 J7.9
3Q  (via drill 0.35)
  Top 0.152: Q10.1 52.68,88.24 50.33,85.89 50.33,80.32 51.5,79.14 v52.45,79.14 | v110.47,74 108.85,75.62 61.77,75.62 58.68,78.72 | 58.68,78.72 58.66,78.74 | 58.68,78.72 58.21,78.72 v58.06,78.87
  Bottom 0.152: U5.9 116.09,45.32 112.69,48.71 112.69,71.79 v110.47,74 | v52.45,79.14 57.78,79.14 v58.06,78.87
3S
  Top 0.152: U5.12 116.09,49.44 | 116.09,49.44 U5.11 | 116.09,49.44 116.99,48.54 R5.2 120.24,48.43 120.67,48.43 122.49,46.61 122.49,27.33 122.49,27.06 122.49,19.46 J7.8
4Q  (via drill 0.35)
  Top 0.152: Q14.1 69.68,87.32 69.68,77.32 70.73,76.26 109.62,76.26 v112.02,73.86
  Bottom 0.152: v112.02,73.86 113.5,72.37 113.5,57.29 116.09,54.71 U5.13
4S
  Top 0.152: U5.15 117.43,58.24 R6.2 123.98,54.54 123.98,20.5 J7.7
5Q  (via drill 0.35)
  Top 0.152: Q4.1 90.05,88.76 87.68,86.39 87.68,80.95 91.37,77.25 126.16,77.25 v126.22,77.19
  Bottom 0.152: U4.4 136.92,55.03 136.92,72.38 132.14,77.15 126.26,77.15 v126.22,77.19
5S
  Top 0.152: U4.3 135.12,55.81 | 135.12,55.81 U4.2 | 129.08,55.78 R41.2 | R41.2 127.5,55.73 126.82,55.04 126.82,20.21 J7.6 | R41.2 135.04,55.73 135.12,55.81
6Q  (via drill 0.35)
  Top 0.152: v132.57,78.25 128.7,78.25 127.96,78.99 107.15,78.99 104.89,81.25 104.89,86.03 106.18,87.32 Q8.1
  Bottom 0.152: U4.7 135.12,45.72 137.84,48.44 137.84,73.02 133.33,77.54 133.3,77.54 v132.58,78.26 v132.57,78.25
6S
  Top 0.152: U4.6 134.21,47.25 130.95,47.25 R42.2 | R42.2 130.14,47.21 | R42.2 128.92,45.22 128.92,20.64 J7.5 130.64,19.32
7Q  (via drill 0.35)
  Top 0.152: v134.02,78.63 133.42,79.24 133.42,86.32 Q12.1
  Bottom 0.152: U4.9 139.44,46.7 139.44,73.18 134.01,78.61 v134.02,78.63
7S
  Top 0.152: U4.12 143.06,48.83 | 143.06,48.83 143.06,48.25 | 143.06,48.25 U4.11 | 143.84,48.05 143.06,48.83 | 143.06,48.25 143.27,48.05 R43.2 149.22,47.41 153.11,47.41 153.24,47.27 154.12,46.4 154.12,36.32 148.45,30.64 140.66,30.64 132.98,22.96 J7.4
8Q  (via drill 0.35)
  Top 0.152: v138.86,79.8 143,83.93 143,88.36 Q16.1
  Bottom 0.152: U4.13 143.06,54.54 140.65,56.96 140.65,73.63 138.86,75.41 v138.86,79.8
8S
  Top 0.152: U4.15 143.84,57.54 R44.2 154.28,57.54 156.25,55.57 156.25,47.62 157.39,46.47 157.39,37.03 149.61,29.25 141.06,29.25 135.52,23.7 J7.3
+5V  (via drill 0.35)
  Top 0.152: U2.4 U2.2 | 64.45,23.45 C2.1 80.55,23.27 88.08,15.75 U2.2 | TP2.TP 100.91,21.27 100.91,18.75 U2.4 | U3.24 39.62,38.14 40.07,38.14 41.35,36.86 U3.34 41.27,29.1 41.27,25.26 42.78,23.75 50.31,23.75 50.67,24.12 50.67,27.82 U3.44 49.32,30.49 50.55,31.72 U3.2 50.75,32.05 50.24,32.05 48.05,34.24 48.05,40.33 U3.14 47.72,41.86 48.56,42.7 52.34,42.7 53.83,44.18 53.83,44.77 54.19,45.14 R72.2 59.29,45.14 v59.87,44.56 | U4.16 143.06,62.2 140.87,64.39 126.82,64.39 R2.2 124.55,62.12 U5.16 118.17,64.21 118.17,65.4 v118.05,65.52 | 64.85,34.97 68.25,34.97 U$1.17 70.43,35.36 v70.48,35.3 | 64.85,34.97 67.03,32.78 67.03,27.1 | 64.85,34.97 64.47,35.35 v64.47,35.38 | v93.05,62.09 99.94,68.98 v114.94,68.98 v114.95,68.99 | U1.3 90.57,62.35 v90.62,62.3 | v53.54,26.45 52.2,27.8 50.66,27.8 | U2.2 91.22,16.47 81.66,26.02 67.63,26.02 67.03,26.62 67.03,27.1 | v60.81,25.94 61.5,25.94 62.65,27.1 67.03,27.1 | U2.4 98.13,15.53 109.21,15.53 112.4,18.71 J2.2
  Bottom 0.152: v59.87,44.56 60.05,44.38 61.31,44.38 64.47,41.21 v64.47,35.38 | v118.05,65.52 118.05,66.84 115.91,68.99 v114.95,68.99 | v93.05,62.09 92.84,62.3 v90.62,62.3 85.97,62.3 83.7,60.04 83.7,36.91 82.36,35.58 72.02,35.58 71.74,35.3 v70.48,35.3 | v60.81,25.94 54.05,25.94 v53.54,26.45
CAN_N
  Top 0.152: R34.1 93.22,55.82 | 90.57,58.79 U1.6 90.57,58.37 90.88,58.06 90.88,58.05 92.92,56.01 R34.1 | J5.2 157.63,67.7 133.8,67.7 129.8,71.71 | 129.8,71.71 | 129.8,71.71 129.71,71.8 119.77,71.8 119.68,71.71 | 119.68,71.71 | 119.68,71.71 114.26,66.29 106.54,66.29 106.45,66.2 | 106.45,66.2 | R34.1 94.23,55.82 94.71,55.35 95.6,55.35 106.45,66.2
CAN_P
  Top 0.152: U1.7 91.09,59.46 91.09,60.49 90.91,60.67 90.22,60.67 89.9,60.35 89.9,55.35 91.24,54.02 92.82,54.02 R34.2 | R34.2 92.39,54.45 | J5.1 157.83,67.4 133.68,67.4 129.58,71.49 119.89,71.49 114.38,65.98 106.67,65.98 95.69,55.01 94.11,55.01 93.02,53.92 R34.2
D_N
  Top 0.152: R16.1 47.22,13.99 48.97,15.74 48.97,18.15 49.15,18.33 52.37,18.33 54.93,20.89 54.93,31.66 53.8,32.79 53.09,32.79 53.06,32.76 52.5,32.76 52.27,32.53 U3.3
D_P
  Top 0.152: R18.1 51.03,13.99 49.28,15.74 49.28,18.03 52.37,18.03 | 52.37,18.03 | 52.37,18.03 52.49,18.03 55.23,20.76 55.23,31.79 53.92,33.1 52.85,33.1 52.82,33.06 52.47,33.06 52.21,33.32 U3.4
GND  (12 unrouted)
  Top 0.152: DS1.1 61.68,13.99 C1.2 61,10.78 64.13,7.65 66.92,7.65 67.89,6.68 J3.GND | TP1.TP 59.66,21.66 61.68,19.63 DS1.1 | 62.44,23.94 62.55,23.83 | U3.35 42.13,36.89 40.12,38.9 U3.23 45.68,38.9 46.94,40.16 U3.15 46.94,31.28 48.21,30.01 48.21,29.51 U3.43 48.84,28.87 48.84,28.34 48.87,28.32 C3.2 | C8.2 46.17,71.77 C7.2 C6.2 56.13,71.44 | U1.2 91.84,61.24 | 91.84,61.24 91.84,61.17 87.04,61.17 C9.2 | U1.8 93.11,59.97 91.84,61.24 | C5.2 55.76,70.88 55.58,70.88 56.13,71.44 | 56.13,71.44 C5.2 | C5.2 57.25,70.5 66.89,70.5 C11.2 C10.2 | U2.1 91.22,23.07 93.68,25.53 101.9,25.53 J2.6 | C2.2 62.55,19.27 DS1.1
  pour Top (isolate 0.64): 0.19,132.58 0.19,31.42 31.11,0.49 99.58,0.49 110.16,11.07 157.74,11.07 166.15,19.48 166.15,140.54 158.42,148.28 15.86,148.28 0.18,132.6
HVD
  Top 0.152: J4.2 J4.1 7.65,71.13 | K1.3 20.22,123.94 19,123.94
  Top 3: 19,123.94 13.57,123.94 10.2,127.31 ST1.TP | K1.3 18.96,125.58 R64.1
  Top 3.5: 7.65,71.13 10.42,73.9 10.42,115.36 19,123.94
MISO
  Top 0.152: 68.21,37.9 U$1.15 66.77,37.9 65.75,38.92 65.75,41.8 67.46,43.5 69.64,43.5 69.91,43.24 73.68,43.24 75.7,41.22 75.7,30.09 76.71,29.08 110.08,29.08 112.4,26.76 J2.1
MOSI
  Top 0.152: U$1.14 68.38,38.92 67.19,38.92 66.37,39.73 66.37,41.16 67.51,42.29 73.5,42.29 75.26,40.53 75.26,29.72 76.7,28.28 109.75,28.28 111.08,26.95 111.08,23.08 109.86,21.86 J2.4
N$1
  Top 0.152: Q1.1 19.59,93.46 R11.1 18.5,94.55 R8.1
N$2
  Top 0.152: Q1.2 27.13,98.43 27.13,101.03 25.69,102.47 18.49,102.47 18.49,104.34 R7.1
N$3
  Top 0.152: R11.2 18.56,87.84 Q2.3
N$4
  Top 0.152: K1.1 29.2,107.09 R7.2 30.7,103.39 R9.2
N$5
  Top 0.152: R37.1 R40.1 99.92,94.82 Q3.1
N$6
  Top 0.152: Q4.3 92.99,92.75 R40.2
N$7
  Top 0.152: R38.2 104.4,103.14 R36.2 104.4,109.52 K2.1
N$8
  Top 0.152: Q3.2 103.45,98.17 103.45,101.03 102.01,102.47 94.81,102.47 94.24,103.04 R36.1
N$9
  Top 0.152: Q5.1 37.67,93.46 R22.1 37.51,96.83 R19.1
N$10
  Top 0.152: Q6.3 37.85,88.87 37.21,89.51 37.21,91.1 R22.2
N$11
  Top 0.152: R20.2 49.88,100.83 R17.2 47.58,106.67 K3.1
N$12
  Top 0.152: R17.1 41.62,102.47 45.85,102.47 47.29,101.03 47.29,96.71 46.58,96 Q5.2
N$13
  Top 0.152: Q7.1 117.22,94.48 R49.1 111.09,98.01 R46.1
N$14
  Top 0.152: R49.2 109.43,90.92 Q8.3
N$15
  Top 0.152: R47.2 123.61,100.42 123.61,106.17 R45.2 122.74,107.04 K4.1
N$16
  Top 0.152: Q7.2 120.73,100.53 120.73,102.47 119.29,103.91 113.53,103.91 113.22,104.22 R45.1
N$17
  Top 0.152: Q9.1 57.98,93.46 R27.1 55.64,95.8 R24.1
N$18
  Top 0.152: R27.2 56.11,87.54 Q10.3
N$19
  Top 0.152: K5.1 66.95,105.89 R23.2 68.01,104.83 R25.2
N$20
  Top 0.152: Q9.2 63.18,96.8 64.41,98.03 64.41,101.19 63.13,102.47 57.37,102.47 57.37,104.61 R23.1
N$21
  Top 0.152: Q11.1 132.71,94.98 R54.1 130.66,97.69 R51.1
N$22
  Top 0.152: Q12.3 130.81,95.27 130.62,95.46 R54.2
N$23
  Top 0.152: R52.2 140.92,105.23 R50.2 139.76,107.56 K6.1
N$24
  Top 0.152: Q11.2 139.45,100.39 139.45,102.47 138.01,103.91 132.25,103.91 130.76,105.4 R50.1
N$25
  Top 0.152: R30.1 74.76,98.86 R33.1 81.77,95.33 Q13.1
N$26
  Top 0.152: Q14.3 74.76,89.25 R33.2
N$27
  Top 0.152: R31.2 85.42,103.13 R29.2 85.42,109.8 K7.1
N$28
  Top 0.152: Q13.2 84.73,100.13 84.73,102.47 83.29,103.91 76.09,103.91 75.26,104.74 R29.1
N$29
  Top 0.152: Q15.1 152.85,96.07 R59.1 146.43,96.4 R56.1
N$30
  Top 0.152: Q16.3 146.1,89.45 R59.2
N$31
  Top 0.152: R57.2 157.43,99.72 157.43,104.66 R55.2 157.89,107.97 K8.1
N$32
  Top 0.152: Q15.2 156.14,100.02 156.14,101.18 153.26,104.06 150.38,104.06 149.15,105.29 R55.1
N$33
  Top 0.152: R1.1 74.06,18.73 63.71,18.73 DS1.2
N$34
  Top 0.152: D1.A 74.28,7.67 70.93,7.67 J3.VCC
N$36
  Top 0.152: J1.2 48.72,9.54 R16.2
N$37
  Top 0.152: J1.3 49.35,6.28 49.35,9.32 51.03,11 R18.2
N$38
  Top 0.152: C9.1 87.04,59.46 U1.5
N$51
  Top 0.152: C3.1 47.72,26.56 U3.42
OSC1
  Top 0.152: C11.1 66.89,63.64 R35.2 66,58.75 Y2.2 73.9,46.27 73.9,45.17 76.09,42.98 U$1.8
OSC2
  Top 0.152: C10.1 72.06,62.91 R35.1 75.5,56.93 Y2.1 75.58,54.09 75.58,52.51 81.22,46.87 81.22,42.27 78.42,42.27 U$1.7
PD0  (via drill 0.35)
  Top 0.152: R10.2 30.45,98.68 R9.1 | R12.2 48.35,44.98 44.85,41.49 44.85,40.96 U3.18 | R12.2 48.35,45.37 | 30.12,94.41 R10.2 | R12.2 48.69,44.86 49.75,44.86 51.19,46.3 51.19,52.06 49.75,53.5 45.43,53.5 31.59,67.33 v31.59,72.96 32.41,73.77 32.41,92.78 R10.2
PD1  (via drill 0.35)
  Top 0.152: R20.1 50.21,95.59 R21.2 50.72,94.4 48.9,94.4 48.17,93.68 48.17,81.41 45.98,79.21 v44.24,79.21 | U3.19 44.07,40.99 44.07,41.5 45.93,43.36 45.93,47.84 47.61,49.52 R13.2 37.53,59.79 28.73,59.79 23.91,64.6 v23.64,64.6
  Bottom 0.152: v23.64,64.6 | v23.64,64.6 23.57,64.67 23.57,69.95 32.72,79.1 44.13,79.1 v44.24,79.21
PD2  (via drill 0.35)
  Top 0.152: R25.1 68.22,98.39 R26.2 66.11,93.22 66.11,85.64 64.27,83.8 58.28,83.8 54.34,79.86 54.34,78.25 53.66,77.57 51.51,77.57 50.01,76.07 41.91,76.07 v36.85,71.02 | U3.20 42.95,42.12 43.88,43.04 R14.2 42.61,45.39 42.1,45.89 42.1,50.36 v40.96,51.5
  Bottom 0.152: v40.96,51.5 37.24,55.22 37.24,70.63 v36.85,71.02
PD3  (via drill 0.35)
  Top 0.152: R31.1 87.46,95.92 R32.2 85.52,95.33 84.89,94.7 84.89,91.36 82.04,88.51 82.04,78.95 v80.13,77.04 | U3.21 42.13,43.4 R15.2 35.62,49.91 33.81,49.91 32.51,51.21 v32.51,54.82
  Bottom 0.152: v32.51,54.82 27.54,59.79 27.54,70.15 34.42,77.03 80.12,77.03 v80.13,77.04
PD4  (via drill 0.35)
  Top 0.152: R38.1 R39.2 105.7,93.97 105.07,93.34 105.07,87.89 103.01,85.82 103.01,80.32 v101.34,78.65 | U3.25 39.26,37.63 38.76,37.63 37.6,38.8 35.91,38.8 | R60.2 35.91,38.8 | v24.74,49.53 33.01,41.26 35.23,41.26 35.91,40.58 35.91,38.8
  Bottom 0.152: v24.74,49.53 24.64,49.63 24.64,69.24 33.56,78.16 100.85,78.16 v101.34,78.65
PD5  (via drill 0.35)
  Top 0.152: R47.1 123.2,97.75 R48.2 121.23,92.51 121.02,92.51 118.45,89.93 118.45,82.86 118.02,82.43 112.55,82.43 v112.56,82.44 | U3.22 38.59,40.66 R61.2 34.3,43.61 27.61,50.3 27.61,57.52 v19.14,65.99
  Bottom 0.152: v19.14,65.99 18.93,66.2 18.93,70.39 30.98,82.44 110.83,82.44 | v112.56,82.44 110.83,82.44 | 110.83,82.44
PD6  (via drill 0.35)
  Top 0.152: R52.1 142.44,100.63 R53.2 142.89,97.36 143.03,97.51 141,97.51 140.15,96.66 140.15,89.53 137.59,86.97 137.59,82.58 v134.86,79.85 | U3.26 32.52,36.52 R62.2 22.16,46.89 22.16,49.85 v22.02,49.98
  Bottom 0.152: v22.02,49.98 22.02,70.25 31.67,79.9 134.81,79.9 v134.86,79.85
PD7  (via drill 0.35)
  Top 0.152: R57.1 159.21,96.04 R58.2 157.06,90.15 155.77,88.86 155.77,83.88 v154.2,82.3 | U3.27 36.64,35.7 R63.2 36.09,33.8 33.76,31.46 31.5,31.46 19.33,43.64 19.33,48.88 v20.37,49.93
  Bottom 0.152: v20.37,49.93 20.37,70.44 31.12,81.19 152.87,81.19 153.99,82.3 v154.2,82.3
R  (via drill 0.35)
  Top 0.152: 115.69,46.88 | 115.69,46.88 U5.10 116.43,46.88 | 115.69,46.88 113.23,46.88 U5.5 111.01,51.96 U5.14 114.44,57.04 109.36,62.12 U5.1 | U4.10 143.05,45.6 142,45.6 136.9,50.7 U4.5 140.2,55.78 U4.14 138.09,60.76 135.17,60.76 135.1,60.83 | 135.1,60.83 U4.1 | 135.1,60.83 134.27,61.66 R2.1 125.99,59.4 v125.53,58.94
  Bottom 0.152: 143.26,45.62 U4.10 143.94,45.62 146.68,42.88 146.68,32.71 138.06,24.09 J7.2 | v125.53,58.94 124.9,58.32 124.9,44.84 122.53,42.47 120.08,42.47 118.17,44.37 118.17,46.52 117.81,46.88 U5.10
RELAY1
  Top 0.152: 36.8,129.44 R66.1
  Top 3: K1.2 29.12,126.48 R64.2 36.8,129.44 | R66.1 37.55,130.19 37.55,127.18 K3.3
RELAY2
  Top 3: K3.2 47.72,124.9 R66.2 R68.1 59.96,127.03 K5.3
RELAY3
  Top 3: K5.2 66.96,125.95 R68.2 69.75,132.99 74.69,132.99 R70.1 76.04,127.97 K7.3
RELAY4
  Top 3: K7.2 86.2,126.45 R70.2 93.34,131.64 R65.1 97.03,127.94 K2.3
RELAY5
  Top 0.152: 112.02,130.88 R67.1
  Top 3: K2.2 103.38,127.13 104.26,128.01 R65.2 112.02,130.88 | R67.1 115.75,127.14 K4.3
RELAY6
  Top 3: K4.2 122.86,125.87 R67.2 R69.1 132.77,127.92 K6.3
RELAY7
  Top 0.152: R69.2 140.85,130.01 | 140.85,130.01 140.89,129.97 140.89,129.83 | 148.78,129.98 R71.1 | 141.19,130.35 140.85,130.01
  Top 3: K6.2 139.12,128.66 R69.2 | K8.3 149.15,127.8 R71.1 141.19,130.35
RELAY8
  Top 0.152: J6.1 J6.2
  Top 3: J6.1 99.47,142.45 105.14,136.79 152.87,136.79 R71.2 159.31,128.1 K8.2 157.26,124.93 158.56,123.63 160.29,123.63 162.92,126.26 162.92,134.34 ST2.TP
RST
  Top 0.152: U3.13 48.84,40.96 48.84,41.49 49.15,41.8 53.78,41.8 R72.1 61.3,37.15 71.26,37.15 74.06,34.35 74.06,28.88 75.91,27.02 106.11,27.02 J2.5
RX_CAN
  Top 0.152: U1.4 86.14,64.42 82.34,60.63 82.34,36.67 81.02,35.36 U$1.2
SCLK
  Top 0.152: U$1.13 69.13,40.44 | 69.13,40.44 69.41,40.44 | 69.13,40.44 69.6,40.9 73.14,40.9 74.72,39.33 74.72,29.39 76.31,27.81 107.86,27.81 J2.3
SS
  Top 0.152: U$1.16 68.34,36.34 51.26,36.34 U3.8
TX_CAN
  Top 0.152: U$1.1 81.21,34.09 83.13,36.01 83.13,60.35 85.84,63.06 89.48,63.06 89.98,63.55 89.98,65.38 90.22,65.63 90.23,65.63 90.62,66.01 92.9,66.01 93.11,65.81 U1.1
UCAP
  Top 0.152: U3.6 54.48,34.92 56.06,33.33 56.06,12.62 55.97,12.53 C4.1
UGND
  Top 0.152: J1.11 55.41,10.08 55.93,10.08 C4.2 54.2,10.05 52.69,11.56 52.69,12.03 55.7,15.05 55.7,32.7 54.27,34.13 U3.5 | J1.10 46.94,3.73 J1.8 48.15,3.43 J1.S1 J1.S2 51.84,3.18 J1.9 51.79,3.73 J1.11 | J1.11 51.59,6.25 J1.5
VBUS  (via drill 0.35)
  Top 0.152: U3.7 62.05,35.7 65.34,32.42 v65.34,29.48 | J1.1 48.07,7.68 45,10.75 45,18.36 v48.58,21.95
  Bottom 0.152: v65.34,29.48 65.71,29.1 65.71,28.67 60.48,23.44 49.43,23.44 48.58,22.58 v48.58,21.95
VCC  (via drill 0.35)  (2 unrouted)
  Top 0.152: R1.2 76.42,18.27 76.42,14 | TP3.TP 85.7,9.3 81.48,9.3 76.83,13.95 76.81,13.95 76.77,13.98 | 76.42,14.34 76.32,14.44 | Q1.3 22.41,100.83 R8.2 16.61,98.94 16.61,41.18 26.31,31.48 v26.51,31.48 | Q5.3 43.42,99.06 R19.2 34.68,99.07 v33.14,97.53 | Q9.3 61.22,100.5 R24.2 55.35,100.21 53.95,100.21 53.05,99.31 v53.05,97.26 | Q13.3 76.12,100.06 R30.2 74.66,100.66 72.72,100.66 72.42,100.37 v72.42,97.52 | Q3.3 93.75,98.54 R37.2 90.85,99.47 90.17,98.8 v90.17,96.96 | Q7.3 117.38,100.24 R46.2 109.89,100.24 109.35,99.7 109.35,96.65 v109.49,96.51 | Q11.3 132.28,100.06 R51.2 126.99,98.01 v126.99,97.36 | Q15.3 148.05,100.21 R56.2 144.42,99.82 v144.42,99.09 | 64.57,13.3 62.91,13.3 C1.1 | v65.95,15.03 65.95,14.68 64.57,13.3 | U2.3 79.64,13.46 79.14,13.96 76.47,13.96 76.42,14 | 64.57,13.3 73.43,13.3 74.04,13.91 D1.C 76.42,14
  Bottom 0.152: Q1.3 25.71,97.53 v33.14,97.53 | v53.05,97.26 46.47,97.26 45.2,98.54 Q5.3 | Q9.3 64.66,98.54 66.02,97.18 72.09,97.18 v72.42,97.52 | v90.17,96.96 86.64,96.96 83.54,100.06 Q13.3 | v109.49,96.51 105.1,96.51 103.07,98.54 Q3.3 | v126.99,97.36 120.26,97.36 Q7.3 | v144.42,99.09 137.55,99.09 Q11.3 | v65.95,15.03 v65.95,15.04 65.95,16.32 65.43,16.83 54.2,16.83 50.32,20.71 37.27,20.71 v26.51,31.48
XTAL1  (1 unrouted)
  Top 0.152: 45.43,40.54 45.34,40.63 U3.17 | 45.34,41.18 U3.17 | 46.1,60.03 46.1,63.28 R28.2 46.5,67.46 C7.1 42.11,69.54 C8.1 | Y1.1 46.31,58.38 49.75,54.94 51.19,54.94 52.63,53.5 52.63,44.86 51.49,43.72 47.87,43.72 45.64,41.49 45.64,40.96 U3.17
XTAL2
  Top 0.152: C5.1 C6.1 51.73,69.22 51.73,67.01 R28.1 51.21,64.65 Y1.2 50.73,60.24 49.75,59.26 49.75,57.82 51.19,56.38 53.46,56.38 53.46,44.25 52.63,43.42 48.38,43.42 46.45,41.49 46.45,40.99 U3.16

### Text on the board
bNames: Hussain Sabunwala